# Altium schematic sheet FPGA_UAV.SchDoc
size A
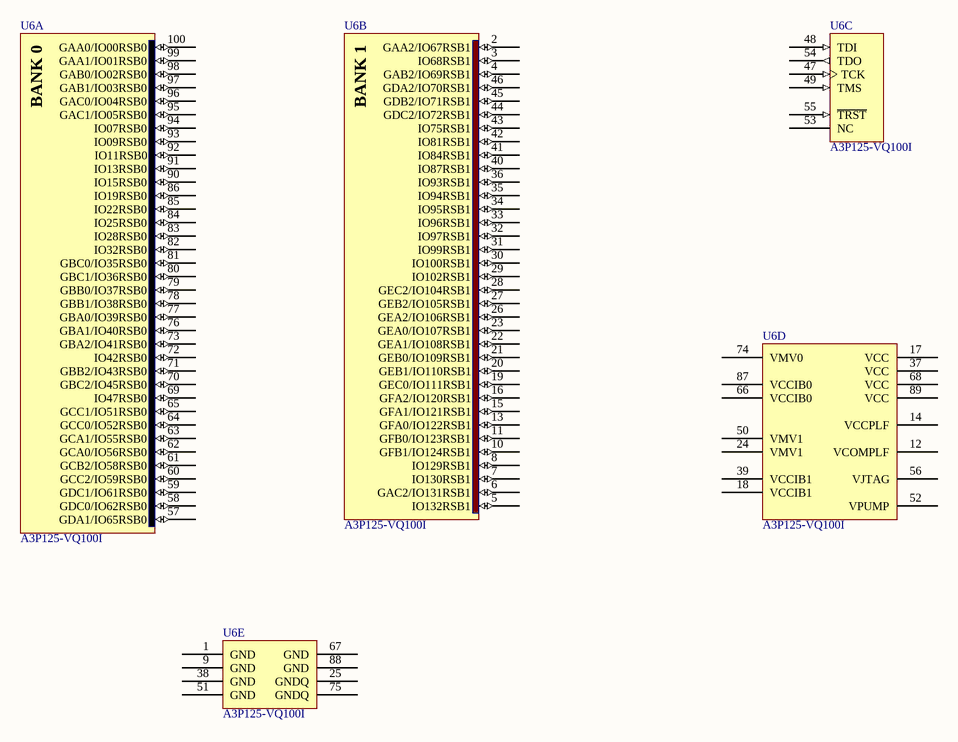
[diagram p0: FPGA_UAV.SchDoc]

## Parts
U6  A3P125-VQ100I  [VQ100_M]  (parts A,B,C,D,E of 5)

## Nets

Not connected (* = marked no-connect by the designer): U6 1(GND) 2(GAA2/IO67RSB1) 3(IO68RSB1) 4(GAB2/IO69RSB1) 5(IO132RSB1) 6(GAC2/IO131RSB1) 7(IO130RSB1) 8(IO129RSB1) 9(GND) 10(GFB1/IO124RSB1) 11(GFB0/IO123RSB1) 12(VCOMPLF) 13(GFA0/IO122RSB1) 14(VCCPLF) 15(GFA1/IO121RSB1) 16(GFA2/IO120RSB1) 17(VCC) 18(VCCIB1) 19(GEC0/IO111RSB1) 20(GEB1/IO110RSB1) 21(GEB0/IO109RSB1) 22(GEA1/IO108RSB1) 23(GEA0/IO107RSB1) 24(VMV1) 25(GNDQ) 26(GEA2/IO106RSB1) 27(GEB2/IO105RSB1) 28(GEC2/IO104RSB1) 29(IO102RSB1) 30(IO100RSB1) 31(IO99RSB1) 32(IO97RSB1) 33(IO96RSB1) 34(IO95RSB1) 35(IO94RSB1) 36(IO93RSB1) 37(VCC) 38(GND) 39(VCCIB1) 40(IO87RSB1) 41(IO84RSB1) 42(IO81RSB1) 43(IO75RSB1) 44(GDC2/IO72RSB1) 45(GDB2/IO71RSB1) 46(GDA2/IO70RSB1) 47(TCK) 48(TDI) 49(TMS) 50(VMV1) 51(GND) 52(VPUMP) 53(NC) 54(TDO) 55(~{TRST}) 56(VJTAG) 57(GDA1/IO65RSB0) 58(GDC0/IO62RSB0) 59(GDC1/IO61RSB0) 60(GCC2/IO59RSB0) 61(GCB2/IO58RSB0) 62(GCA0/IO56RSB0) 63(GCA1/IO55RSB0) 64(GCC0/IO52RSB0) 65(GCC1/IO51RSB0) 66(VCCIB0) 67(GND) 68(VCC) 69(IO47RSB0) 70(GBC2/IO45RSB0) 71(GBB2/IO43RSB0) 72(IO42RSB0) 73(GBA2/IO41RSB0) 74(VMV0) 75(GNDQ) 76(GBA1/IO40RSB0) 77(GBA0/IO39RSB0) 78(GBB1/IO38RSB0) 79(GBB0/IO37RSB0) 80(GBC1/IO36RSB0) 81(GBC0/IO35RSB0) 82(IO32RSB0) 83(IO28RSB0) 84(IO25RSB0) 85(IO22RSB0) 86(IO19RSB0) 87(VCCIB0) 88(GND) 89(VCC) 90(IO15RSB0) 91(IO13RSB0) 92(IO11RSB0) 93(IO09RSB0) 94(IO07RSB0) 95(GAC1/IO05RSB0) 96(GAC0/IO04RSB0) 97(GAB1/IO03RSB0) 98(GAB0/IO02RSB0) 99(GAA1/IO01RSB0) 100(GAA0/IO00RSB0)

## Notes on the sheet
- (in symbol CMP-0097-00437-1, part A) BANK 0
- (in symbol CMP-0097-00437-1, part B) BANK 1

## Library data of the parts
U6 = CMP-0097-00437-1: ProASIC3 Flash Family FPGA, 71 User IOs, 125K System Gates, 36 Kbits RAM, 1 Kbit Flash ROM, 1 PLL, 100-Pin VQFP, Industrial Grade; DatasheetVersion: v1.3, Oct-2009; PackageVersion: ver11.2, Nov-2009; PackageReference: VQ100; Code_JEDEC: MS-026-AED; PackageDescription: 100-Pin Plastic Quad Flat Pack (VQ100)